# Altium schematic sheet RGB_LED_2.SchDoc
size A4
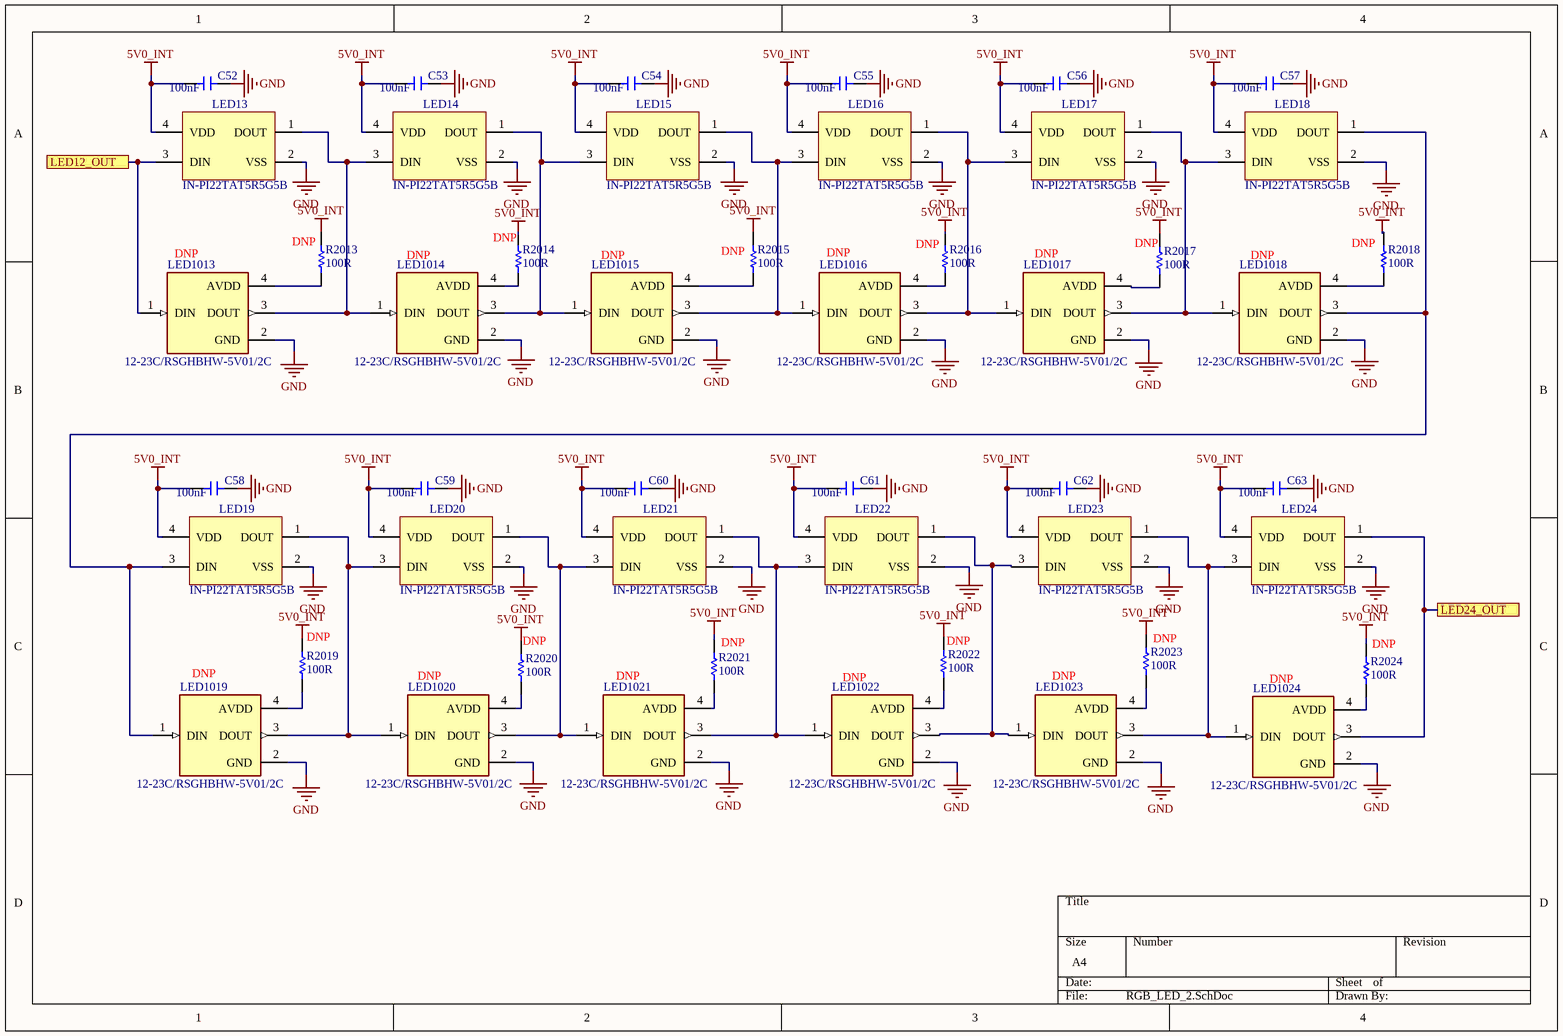
[diagram p0: RGB_LED_2.SchDoc]

## Parts
C52  value 100nF  [CAP_0402_CER]  (hidden comment: CL05B104KP5NNNC)
C53  value 100nF  [CAP_0402_CER]  (hidden comment: CL05B104KP5NNNC)
C54  value 100nF  [CAP_0402_CER]  (hidden comment: CL05B104KP5NNNC)
C55  value 100nF  [CAP_0402_CER]  (hidden comment: CL05B104KP5NNNC)
C56  value 100nF  [CAP_0402_CER]  (hidden comment: CL05B104KP5NNNC)
C57  value 100nF  [CAP_0402_CER]  (hidden comment: CL05B104KP5NNNC)
C58  value 100nF  [CAP_0402_CER]  (hidden comment: CL05B104KP5NNNC)
C59  value 100nF  [CAP_0402_CER]  (hidden comment: CL05B104KP5NNNC)
C60  value 100nF  [CAP_0402_CER]  (hidden comment: CL05B104KP5NNNC)
C61  value 100nF  [CAP_0402_CER]  (hidden comment: CL05B104KP5NNNC)
C62  value 100nF  [CAP_0402_CER]  (hidden comment: CL05B104KP5NNNC)
C63  value 100nF  [CAP_0402_CER]  (hidden comment: CL05B104KP5NNNC)
LED13  IN-PI22TAT5R5G5B  [RGB_IN-PI22TAT5R5G5B]
LED14  IN-PI22TAT5R5G5B  [RGB_IN-PI22TAT5R5G5B]
LED15  IN-PI22TAT5R5G5B  [RGB_IN-PI22TAT5R5G5B]
LED16  IN-PI22TAT5R5G5B  [RGB_IN-PI22TAT5R5G5B]
LED17  IN-PI22TAT5R5G5B  [RGB_IN-PI22TAT5R5G5B]
LED18  IN-PI22TAT5R5G5B  [RGB_IN-PI22TAT5R5G5B]
LED19  IN-PI22TAT5R5G5B  [RGB_IN-PI22TAT5R5G5B]
LED20  IN-PI22TAT5R5G5B  [RGB_IN-PI22TAT5R5G5B]
LED21  IN-PI22TAT5R5G5B  [RGB_IN-PI22TAT5R5G5B]
LED22  IN-PI22TAT5R5G5B  [RGB_IN-PI22TAT5R5G5B]
LED23  IN-PI22TAT5R5G5B  [RGB_IN-PI22TAT5R5G5B]
LED24  IN-PI22TAT5R5G5B  [RGB_IN-PI22TAT5R5G5B]
LED1013  12-23C/RSGHBHW-5V01/2C  Place: DNP  [LED_12-23C/RSGHBHW-5V01/2C]  (no BOM)
LED1014  12-23C/RSGHBHW-5V01/2C  Place: DNP  [LED_12-23C/RSGHBHW-5V01/2C]  (no BOM)
LED1015  12-23C/RSGHBHW-5V01/2C  Place: DNP  [LED_12-23C/RSGHBHW-5V01/2C]  (no BOM)
LED1016  12-23C/RSGHBHW-5V01/2C  Place: DNP  [LED_12-23C/RSGHBHW-5V01/2C]  (no BOM)
LED1017  12-23C/RSGHBHW-5V01/2C  Place: DNP  [LED_12-23C/RSGHBHW-5V01/2C]  (no BOM)
LED1018  12-23C/RSGHBHW-5V01/2C  Place: DNP  [LED_12-23C/RSGHBHW-5V01/2C]  (no BOM)
LED1019  12-23C/RSGHBHW-5V01/2C  Place: DNP  [LED_12-23C/RSGHBHW-5V01/2C]  (no BOM)
LED1020  12-23C/RSGHBHW-5V01/2C  Place: DNP  [LED_12-23C/RSGHBHW-5V01/2C]  (no BOM)
LED1021  12-23C/RSGHBHW-5V01/2C  Place: DNP  [LED_12-23C/RSGHBHW-5V01/2C]  (no BOM)
LED1022  12-23C/RSGHBHW-5V01/2C  Place: DNP  [LED_12-23C/RSGHBHW-5V01/2C]  (no BOM)
LED1023  12-23C/RSGHBHW-5V01/2C  Place: DNP  [LED_12-23C/RSGHBHW-5V01/2C]  (no BOM)
LED1024  12-23C/RSGHBHW-5V01/2C  Place: DNP  [LED_12-23C/RSGHBHW-5V01/2C]  (no BOM)
R2013  value 100R  Place: DNP  [RES_0402_SMD]  (hidden comment: RMCF0402JT100R)  (no BOM)
R2014  value 100R  Place: DNP  [RES_0402_SMD]  (hidden comment: RMCF0402JT100R)  (no BOM)
R2015  value 100R  Place: DNP  [RES_0402_SMD]  (hidden comment: RMCF0402JT100R)  (no BOM)
R2016  value 100R  Place: DNP  [RES_0402_SMD]  (hidden comment: RMCF0402JT100R)  (no BOM)
R2017  value 100R  Place: DNP  [RES_0402_SMD]  (hidden comment: RMCF0402JT100R)  (no BOM)
R2018  value 100R  Place: DNP  [RES_0402_SMD]  (hidden comment: RMCF0402JT100R)  (no BOM)
R2019  value 100R  Place: DNP  [RES_0402_SMD]  (hidden comment: RMCF0402JT100R)  (no BOM)
R2020  value 100R  Place: DNP  [RES_0402_SMD]  (hidden comment: RMCF0402JT100R)  (no BOM)
R2021  value 100R  Place: DNP  [RES_0402_SMD]  (hidden comment: RMCF0402JT100R)  (no BOM)
R2022  value 100R  Place: DNP  [RES_0402_SMD]  (hidden comment: RMCF0402JT100R)  (no BOM)
R2023  value 100R  Place: DNP  [RES_0402_SMD]  (hidden comment: RMCF0402JT100R)  (no BOM)
R2024  value 100R  Place: DNP  [RES_0402_SMD]  (hidden comment: RMCF0402JT100R)  (no BOM)

## Ports
LED12_OUT, LED24_OUT

## Nets
5V0_INT: C52.2 C53.2 C54.2 C55.2 C56.2 C57.2 C58.2 C59.2 C60.2 C61.2 C62.2 C63.2 LED13.4(VDD) LED14.4(VDD) LED15.4(VDD) LED16.4(VDD) LED17.4(VDD) LED18.4(VDD) LED19.4(VDD) LED20.4(VDD) LED21.4(VDD) LED22.4(VDD) LED23.4(VDD) LED24.4(VDD) R2013.1 R2014.1 R2015.1 R2016.1 R2017.1 R2018.1 R2019.1 R2020.1 R2021.1 R2022.1 R2023.1 R2024.1
GND: C52.1 C53.1 C54.1 C55.1 C56.1 C57.1 C58.1 C59.1 C60.1 C61.1 C62.1 C63.1 LED13.2(VSS) LED14.2(VSS) LED15.2(VSS) LED16.2(VSS) LED17.2(VSS) LED18.2(VSS) LED19.2(VSS) LED20.2(VSS) LED21.2(VSS) LED22.2(VSS) LED23.2(VSS) LED24.2(VSS) LED1013.2(GND) LED1014.2(GND) LED1015.2(GND) LED1016.2(GND) LED1017.2(GND) LED1018.2(GND) LED1019.2(GND) LED1020.2(GND) LED1021.2(GND) LED1022.2(GND) LED1023.2(GND) LED1024.2(GND)
LED12_OUT: LED13.3(DIN) LED1013.1(DIN) ; port LED12_OUT
LED24_OUT: LED24.1(DOUT) LED1024.3(DOUT) ; port LED24_OUT
NetLED13_1: LED13.1(DOUT) LED14.3(DIN) LED1013.3(DOUT) LED1014.1(DIN)
NetLED14_1: LED14.1(DOUT) LED15.3(DIN) LED1014.3(DOUT) LED1015.1(DIN)
NetLED15_1: LED15.1(DOUT) LED16.3(DIN) LED1015.3(DOUT) LED1016.1(DIN)
NetLED16_1: LED16.1(DOUT) LED17.3(DIN) LED1016.3(DOUT) LED1017.1(DIN)
NetLED17_1: LED17.1(DOUT) LED18.3(DIN) LED1017.3(DOUT) LED1018.1(DIN)
NetLED18_1: LED18.1(DOUT) LED19.3(DIN) LED1018.3(DOUT) LED1019.1(DIN)
NetLED19_1: LED19.1(DOUT) LED20.3(DIN) LED1019.3(DOUT) LED1020.1(DIN)
NetLED20_1: LED20.1(DOUT) LED21.3(DIN) LED1020.3(DOUT) LED1021.1(DIN)
NetLED21_1: LED21.1(DOUT) LED22.3(DIN) LED1021.3(DOUT) LED1022.1(DIN)
NetLED22_1: LED22.1(DOUT) LED23.3(DIN) LED1022.3(DOUT) LED1023.1(DIN)
NetLED23_1: LED23.1(DOUT) LED24.3(DIN) LED1023.3(DOUT) LED1024.1(DIN)
NetLED1013_4: LED1013.4(AVDD) R2013.2
NetLED1014_4: LED1014.4(AVDD) R2014.2
NetLED1015_4: LED1015.4(AVDD) R2015.2
NetLED1016_4: LED1016.4(AVDD) R2016.2
NetLED1017_4: LED1017.4(AVDD) R2017.2
NetLED1018_4: LED1018.4(AVDD) R2018.2
NetLED1019_4: LED1019.4(AVDD) R2019.2
NetLED1020_4: LED1020.4(AVDD) R2020.2
NetLED1021_4: LED1021.4(AVDD) R2021.2
NetLED1022_4: LED1022.4(AVDD) R2022.2
NetLED1023_4: LED1023.4(AVDD) R2023.2
NetLED1024_4: LED1024.4(AVDD) R2024.2

## Library data of the parts
C52-C63 = CAP_GEN_CER: 100nF 0402 Ceramic Capacitor; Voltage: 10V; Place: POP; Part Number: CL05B104KP5NNNC; Power: *; Package: *; Tolerance: *; Operating Temp.: *
LED13-LED24 = IN-PI22TAT5R5G5B: ADDRESS LED DISCRETE SERIAL RGB; Manufacturer: Inolux; Place: P; Part Number: IN-PI22TAT5R5G5B; Operating Temp.: -40°C ~ 85°C; Power: N/A; Tolerance: N/A; Value: N/A; Voltage: N/A; Package: IN-PI22TAT5R5G5B
LED1013-LED1024 = 12-23C/RSGHBHW-5V01/2C: Addressable Lighting series 1 LED Discrete Serial (Shift Register) Red, Green, Blue (RGB) 3.00mm L x 1.00mm W; MF: Everlight Electronics Co Ltd; Package: SMD-4 Everlight Electronics Co Ltd; SnapEDA_Link: https://www.snapeda.com/parts/12-23C/RSGHBHW-5V01/2C/Everlight+Electronics+Co+Ltd/view-part/?ref=snap; MP: 12-23C/RSGHBHW-5V01/2C; Purchase-URL: https://pricing.snapeda.com/search/part/12-23C/RSGHBHW-5V01/2C/?ref=eda; Value: *; Availability: In Stock; Price: None; Check_prices: https://www.snapeda.com/parts/12-23C/RSGHBHW-5V01/2C/Everlight+Electronics+Co+Ltd/view-part/?ref=eda; Part Number: 12-23C/RSGHBHW-5V01/2C
R2013-R2024 = RES_GEN_SMD: Generic Chip Res 100R; Tolerance: 5 %; Package: *; Part Number: RMCF0402JT100R; Power: *; Voltage: *; Operating Temp.: *